# Altium schematic sheet MCU.SchDoc
size A4; SheetNumber: 3; SheetTotal: 6
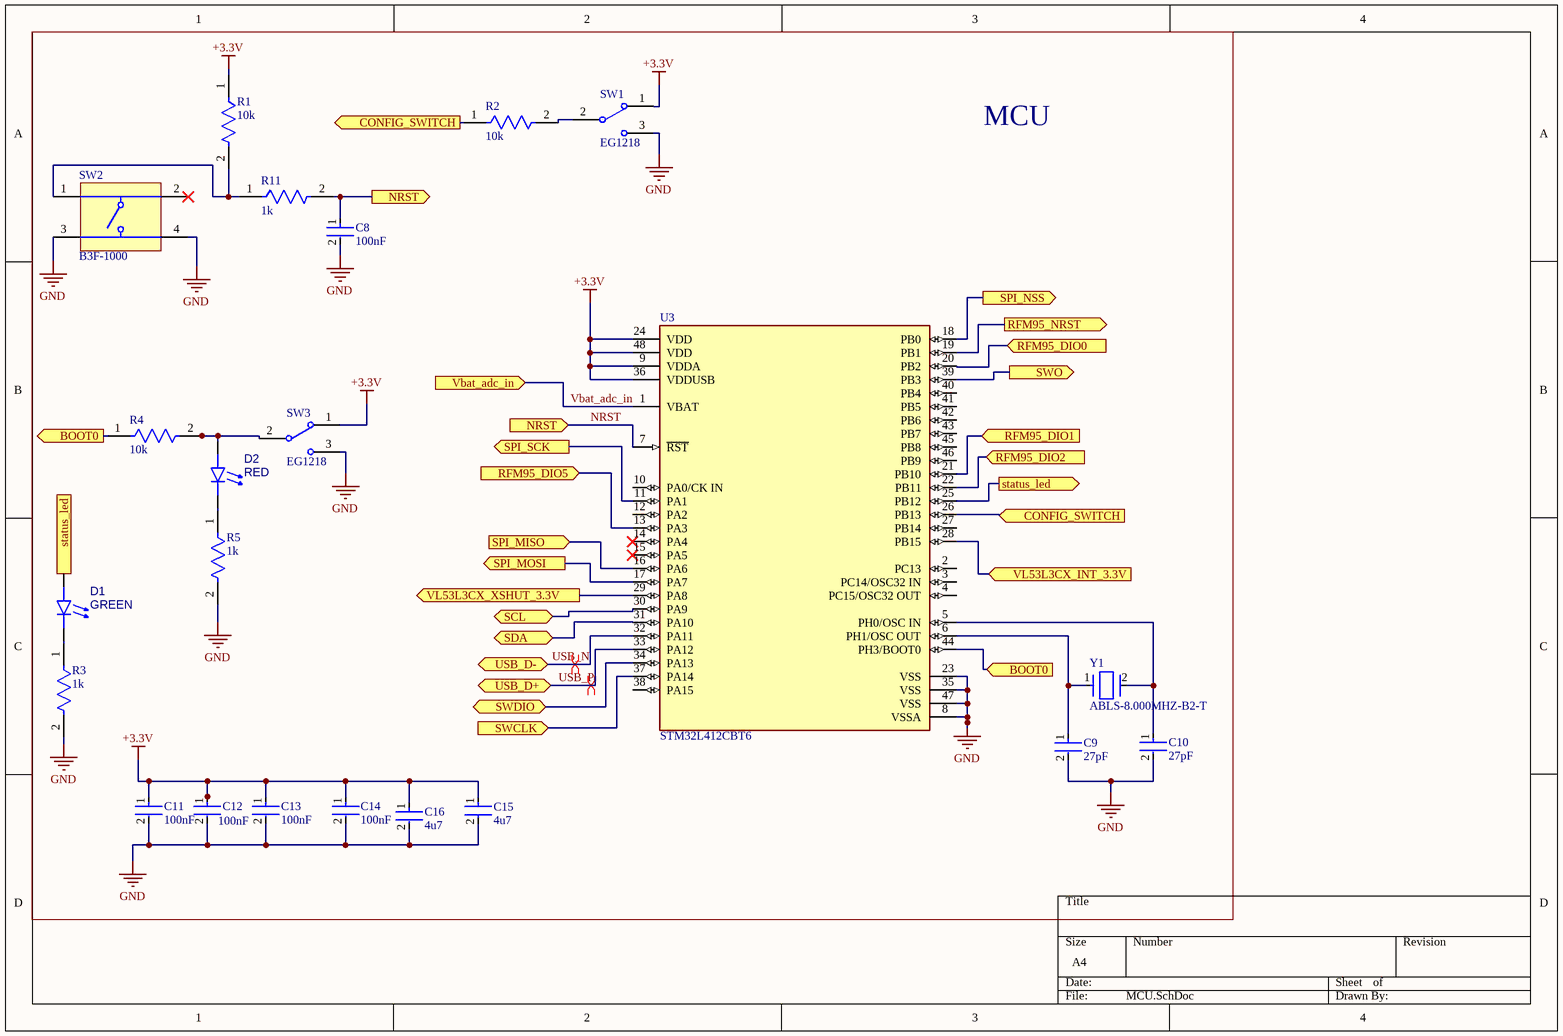
[diagram p0: MCU.SchDoc]

## Parts
C8  100nF  [FP-C1206C-EB-MFG]
C9  27pF  [FP-GCM31A-0_2-MFG]
C10  27pF  [FP-GCM31A-0_2-MFG]
C11  100nF  [FP-C1206C-EB-MFG]
C12  100nF  [FP-C1206C-EB-MFG]
C13  100nF  [FP-C1206C-EB-MFG]
C14  100nF  [FP-C1206C-EB-MFG]
C15  4u7  [FP-GRM21B-0_15-MFG]
C16  4u7  [FP-GRM21B-0_15-MFG]
D1  GREEN  [156120VS75000-Footprint-1]
D2  RED  [156120RS75000-Footprint-1]
R1  10k  [FP-RMCF1206-IPC_C]
R2  10k  [FP-RMCF1206-IPC_C]
R3  1k  [FP-RMCF1206-MFG]
R4  10k  [FP-RMCF1206-IPC_C]
R5  1k  [FP-RMCF1206-MFG]
R11  1k  [FP-RMCF1206-MFG]
SW1  EG1218  [ESWI-EG1218_V]
SW2  B3F-1000  [OMRON-B3F-1000-4_V]
SW3  EG1218  [ESWI-EG1218_V]
U3  STM32L412CBT6  [FP-LQFP48-5B-IPC_A]
Y1  ABLS-8.000MHZ-B2-T  [FP-ABLS-MFG]

## Blocks framed on the sheet
MCU: C8-C16 D1 D2 R1-R5 R11 SW1-SW3 U3 Y1

## Ports
BOOT0 (in, see MCU[1B], Sheet3[5C], Sheet3[7C]), BOOT0 (out, see MCU[3C], Sheet3[5C], Sheet3[7C]), CONFIG_SWITCH (in, see MCU[1A], Sheet3[6C], Sheet3[7B]), CONFIG_SWITCH (out, see MCU[3B], Sheet3[6C], Sheet3[7B]), NRST (in, see Connectors[3C], MCU[1A], Sheet3[3A], Sheet3[6B]), NRST (out, see Connectors[3C], MCU[2B], Sheet3[3A], Sheet3[6B]), RFM95_DIO0 (in, see RFM95[3A], Sheet3[2B], Sheet3[7B]), RFM95_DIO1 (in, see RFM95[3A], Sheet3[2B], Sheet3[7B]), RFM95_DIO2 (in, see RFM95[2A], Sheet3[2B], Sheet3[7B]), RFM95_DIO5 (in, see RFM95[2B], Sheet3[2B], Sheet3[6B]), RFM95_NRST (out, see RFM95[1A], Sheet3[1B], Sheet3[7B]), SCL (bidir, see Sheet3[5A], Sheet3[6C], VL53L3CX[1B]), SDA (bidir, see Sheet3[5A], Sheet3[6C], VL53L3CX[1C]), SPI_MISO (in, see RFM95[1B], Sheet3[1B], Sheet3[6B]), SPI_MOSI (out, see RFM95[1B], Sheet3[1B], Sheet3[6B]), SPI_NSS (out, see RFM95[1B], Sheet3[1B], Sheet3[7B]), SPI_SCK (out, see RFM95[1A], Sheet3[1B], Sheet3[6B]), status_led (in, see MCU[3B], Sheet3[5C], Sheet3[7B]), status_led (out, see MCU[1C], Sheet3[5C], Sheet3[7B]), SWCLK (in, see Connectors[3B], Sheet3[3A], Sheet3[6C]), SWDIO (bidir, see Connectors[3B], Sheet3[3A], Sheet3[6C]), SWO (out, see Connectors[3C], Sheet3[3A], Sheet3[7B]), USB_D+ (bidir, see Connectors[3C], Sheet3[3A], Sheet3[6C]), USB_D- (bidir, see Connectors[3B], Sheet3[3A], Sheet3[6C]), Vbat_adc_in (in, see Board_Power[2A], Sheet3[2A], Sheet3[6B]), VL53L3CX_INT_3.3V (in, see Sheet3[5A], Sheet3[7B], VL53L3CX[1B]), VL53L3CX_XSHUT_3.3V (out, see Sheet3[5A], Sheet3[6B], VL53L3CX[1B])

## Nets
+3.3V: C11.1 C12.1 C13.1 C14.1 C15.1 C16.1 R1.1 SW1.1 SW3.1 U3.9(VDDA) U3.24(VDD) U3.36(VDDUSB) U3.48(VDD)
GND: C8.2 C9.2 C10.2 C11.2 C12.2 C13.2 C14.2 C15.2 C16.2 R3.2 R5.2 SW1.3 SW2.3 SW2.4 SW3.3 U3.8(VSSA) U3.23(VSS) U3.35(VSS) U3.47(VSS)
BOOT0: R4.1 U3.44(PH3/BOOT0) ; port BOOT0
CONFIG_SWITCH: R2.1 U3.26(PB13) ; port CONFIG_SWITCH
NRST: C8.1 R11.2 U3.7(~{RST}) ; port NRST
RFM95_DIO0: U3.20(PB2) ; port RFM95_DIO0
RFM95_DIO1: U3.21(PB10) ; port RFM95_DIO1
RFM95_DIO2: U3.22(PB11) ; port RFM95_DIO2
RFM95_DIO5: U3.13(PA3) ; port RFM95_DIO5
RFM95_NRST: U3.19(PB1) ; port RFM95_NRST
SCL: U3.30(PA9) ; port SCL
SDA: U3.31(PA10) ; port SDA
SPI_MISO: U3.16(PA6) ; port SPI_MISO
SPI_MOSI: U3.17(PA7) ; port SPI_MOSI
SPI_NSS: U3.18(PB0) ; port SPI_NSS
SPI_SCK: U3.11(PA1) ; port SPI_SCK
status_led: D1.2(A) U3.25(PB12) ; port status_led
SWCLK: U3.37(PA14) ; port SWCLK
SWDIO: U3.34(PA13) ; port SWDIO
SWO: U3.39(PB3) ; port SWO
USB_N: U3.32(PA11) ; port USB_D-
USB_P: U3.33(PA12) ; port USB_D+
Vbat_adc_in: U3.1(VBAT) ; port Vbat_adc_in
VL53L3CX_INT_3.3V: U3.28(PB15) ; port VL53L3CX_INT_3.3V
VL53L3CX_XSHUT_3.3V: U3.29(PA8) ; port VL53L3CX_XSHUT_3.3V
NetC9_1: C9.1 U3.6(PH1/OSC_OUT) Y1.1
NetC10_1: C10.1 U3.5(PH0/OSC_IN) Y1.2
NetD1_1: D1.1(K) R3.1
NetD2_1: D2.1(K) R5.1
NetD2_2: D2.2(A) R4.2 SW3.2(COM)
NetR1_2: R1.2 R11.1 SW2.1
NetR2_2: R2.2 SW1.2(COM)

Not connected (* = marked no-connect by the designer): SW2 2*; U3 2(PC13) 3(PC14/OSC32_IN) 4(PC15/OSC32_OUT) 10(PA0/CK_IN) 12(PA2) 14(PA4)* 15(PA5)* 27(PB14) 38(PA15) 40(PB4) 41(PB5) 42(PB6) 43(PB7) 45(PB8) 46(PB9)

## Layout directives
differential pair: USB_N, USB_P

## Library data of the parts
C8 C11-C14 = CMP-03020-021070-1: CAP CER 0.1UF 16V 10% X7R 1206; Manufacturer Part Number: C1206C104K4RACTU; Manufacturer: KEMET; Automotive Grade: Grade 0; Tolerance: 0.1; Temperature Coefficient: 15%; Capacitance: 0.10 μF; Material: Ceramic; Value: 0.10 μF; ComponentLink2URL: https://content.kemet.com/datasheets/KEM_C1007_X8R_ULTRA_150C_SMD.pdf; Voltage Rating: 16 V; Temperature Range Low: -55°C; Device Class L3: Ceramic Capacitors; Device Class L1: Passive Components; Lead Free: Yes; Temperature Characteristic: X7R; Package: C1206C-EB; RoHS: TRUE; Ipc Land Pattern Name: CAPC320160X78; Automotive: Yes; Temperature: -55°C to +150°C; Category: Cap; Digikey Description: CAP CER 0.1UF 16V 10% X7R 1206; Mouser Description: Multilayer Ceramic Capacitors MLCC - SMD/SMT 16volts 0.1uF X7R 10%; ComponentLink2Description: Datasheet; Temperature Range High: +150°C; Device Class L2: Capacitors; Height: 0.88mm; Octopart: https://octopart.com/c1206c104k4ractu-kemet-12577600
C9 C10 = CMP-06035-011656-1: Ceramic Capacitor for Automotive 27pF ±1% 1kVDC C0G 1206 Paper T/R
C15 C16 = CMP-06035-005997-1: Chip Multilayer Ceramic Capacitors for General Purpose, 0805, 4.7uF, X7R, 15%, 10%, 10V; Tolerance: 10%; Capacitance: 4.7uF; Width: 1.25mm; Case/Package: 0805; Voltage Rating (DC): 10V; Thickness: 1.25mm; Dielectric: X7R; Length: 2mm
D1 = CMP-007-00036-1: Single Color LED; RoHS Compliant: Yes
D2 = CMP-007-00037-1: Single Color LED; RoHS Compliant: Yes
R1 R2 R4 = CMP-26527-000061-1: 10kΩ ±5% 0.25W 1206 Thick Film Chip Resistor AEC-Q200 compliant; Resistance: 10kR; Power Rating: 250mW; Temperature Coefficient: 100ppm/°C; Case Code (Metric): 3216; Tolerance: 5%; Length: 3.2mm; Case Code (Imperial): 1206; Lead Free: Lead Free; Depth: 1.6mm; Min Operating Temperature: -55°C; Max Operating Temperature: 155°C; Series: RMCF; Mount: Surface Mount; Packaging: Tape and Reel; Construction: Rectangular; Width: 0.063inch; Number of Terminations: 2; Height: 0.028inch; Resistor Type: Thick Film; Features: Automotive AEC-Q200; Size Code: 1206; Contact Plating: Tin; Case/Package: 1206; RoHS Compliant: Yes; Military Standard: Not; Radiation Hardening: No; Max Power Dissipation: 250mW
R3 R5 R11 = CMP-26527-000044-1: 1kΩ ±5% 0.25W 1206 Thick Film Chip Resistor AEC-Q200 compliant; Temperature Coefficient: 200ppm/°C; Power Rating: 250mW; Working Voltage: 200V; Resistance: 1kR; Min Operating Temperature: -55°C; Mount: Surface Mount; Number of Terminations: 2; Case Code (Imperial): 1206; Case Code (Metric): 3216; Packaging: Tape and Reel; Tolerance: 5%; Height: 0.028inch; Length: 3.2mm; Features: Automotive AEC-Q200; Depth: 1.6mm; RoHS Compliant: Yes; Resistor Type: Thick Film; Width: 0.063inch; Lead Free: Lead Free; Max Power Dissipation: 250mW; Construction: Rectangular; Case/Package: 1206; Max Operating Temperature: 155°C; Contact Plating: Tin; Radiation Hardening: No; Series: RMCF; Military Standard: Not
SW1 SW3 = CMP-011-00006-2: Slide Switch, SPDT, 500 V, -20 to 70 degC, 3-Pin THD, RoHS, Bulk; Manufacturer: E-Switch; Voltage Rating (DC): 30V; Current Rating: 200mA; Operating Force: 250gf; Package Quantity: 1000; Contact Plating: Silver; Max Operating Temperature: 70°C; Min Operating Temperature: -20°C; Contact Material: Copper; Datasheet URL: https://www.e-switch.com/system/asset/product_line/data_sheet/119/EG.pdf; Contact Finish: Silver; Case/Package: EG1218; Voltage Rating (AC): 30V; Datasheet Version: Oct-15; Package Description: 3-Pin Through Hole Device, Body 11.6 x 4 mm, Pitch 2.5 mm; RoHS Compliant: True; Package Reference: EG1218; Manufacturer URL: http://www.e-switch.ch/en/; Throw Configuration: SPDT; Contact Current Rating: 200mA; Mounting Technology: TH; Packaging: Bulk; Pins: 3
SW2 = CMP-011-00004-2: Tactile Switch, SPST-NO, 0.05 A, 24 V, -25 to 70 degC, 4-Pin THD, RoHS, Bulk; Manufacturer: Omron Electronic Components; Throw Configuration: SPST; Max Contact Resistance: 100mohm; Resistance: 0.1Ohm; Max Current Rating: 50mA; Voltage Rating: 24V; Operating Force: 100gf; Datasheet Version: Jan-15; Case/Package: B3F-1000; Packaging: Bulk; Package Description: 4-Pin Through Hole Device, Body 6 x 6 mm; Manufacturer URL: http://www.omron.com/; Package Reference: B3F-1000; Contact Plating: Gold; Contact Current Rating: 50mA; RoHS Compliant: True; Contact Material: Gold; Mounting Technology: TH; Max Operating Temperature: 70°C; Min Operating Temperature: -25°C; Package Quantity: 1500; Datasheet URL: http://www.omron.com/ecb/products/pdf/en-b3f.pdf; Voltage Rating (DC): 24V; Pins: 4; Current Rating: 50mA; Max Voltage Rating (DC): 24V
U3 = CMP-12105-000110-1: IC MCU 32BIT 128KB FLASH 48LQFP; RoHS Compliant: Yes
Y1 = CMP-27762-009874-1: CRYSTAL 8.0000MHZ 18PF SMD; ESR (Equivalent Series Resistance): 80R; Operating Frequency: 8 MHz; Frequency Stability: 50ppm; Tolerance: 20ppm; Frequency: 8MHz; Min Operating Temperature: -20°C; Lead Free: Lead Free; Width: 4.7mm; Packaging: Tape and Reel; Series: ABLS; Accuracy: 20ppm; Length: 11.4mm; Frequency Tolerance: 20ppm; Termination: SMD/SMT; Number of Pins: 2; Radiation Hardening: No; Depth: 4.7mm; REACH SVHC: No SVHC; Contact Plating: Tin; Load Capacitance: 18pF; Case/Package: SMD/SMT; Mount: Surface Mount; Package Quantity: 1000; Max Operating Temperature: 70°C; Height: 0.165inch; Series Resistance: 80R